# Altium project USB 3.1_to_Gigabit_Ethernet_V1.0.PrjPcb (part 2 of 3)
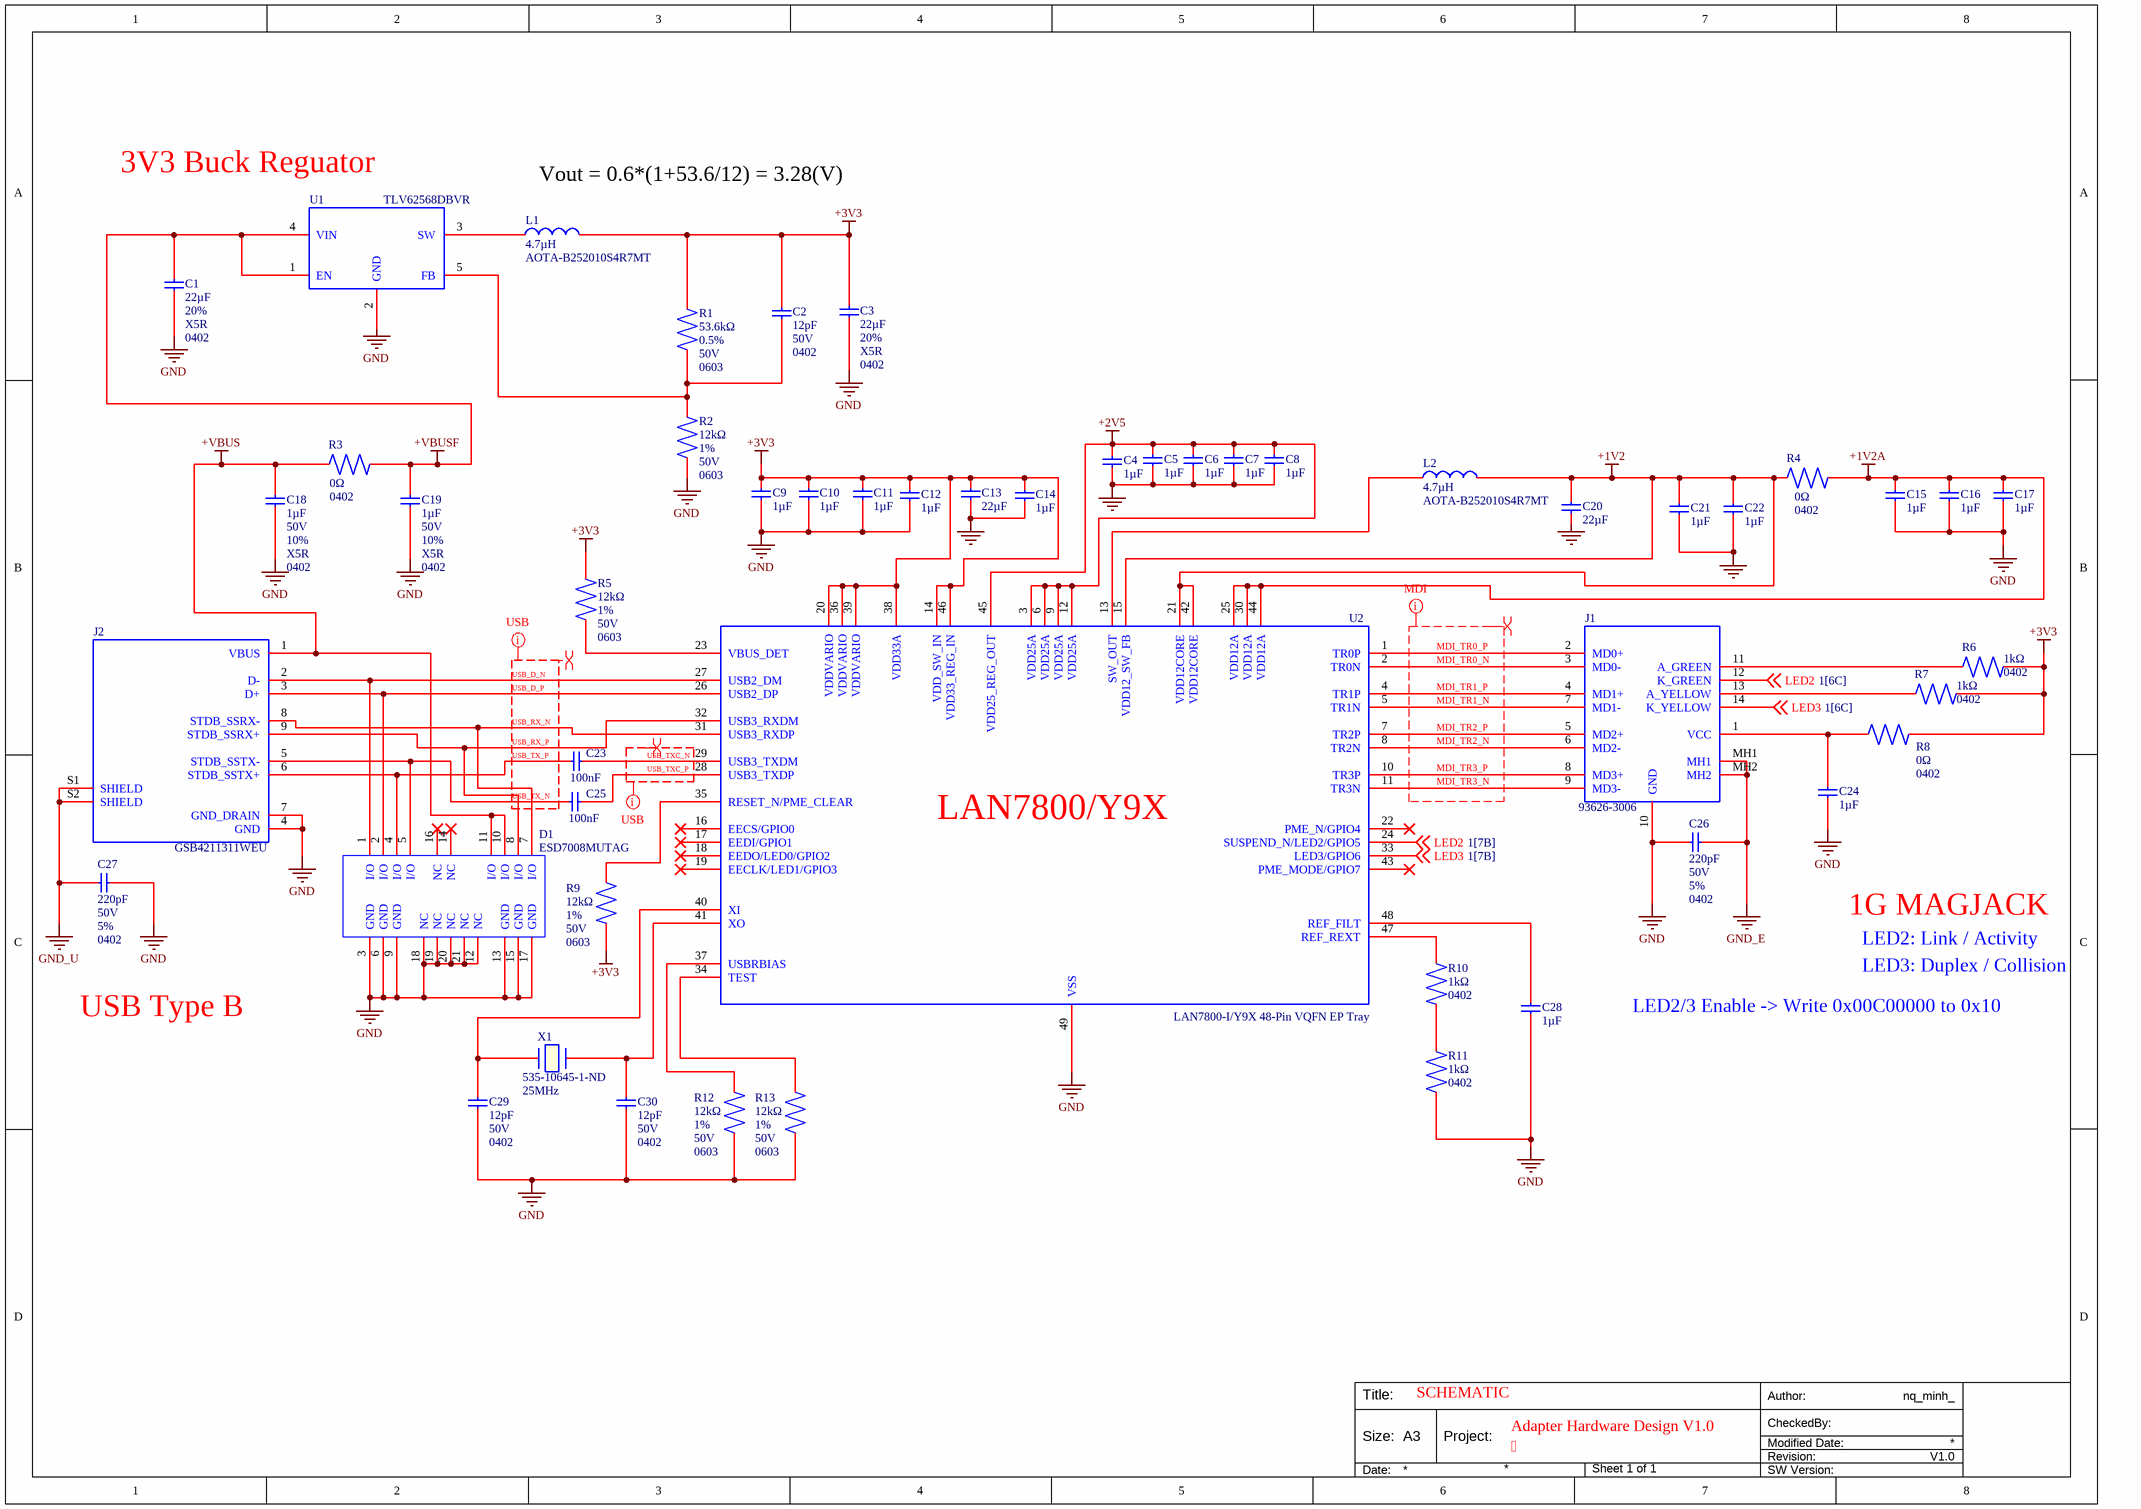
[diagram p1: Schematic.SchDoc]

## Sheet Schematic.SchDoc (continued)
### Library data of the parts
C1 C3 C13 C20 = C0402_MLCC_22uF_X5R_6.3V: 6.3V 22uF X5R ±20% 0402 Multilayer Ceramic Capacitors MLCC - SMD/SMT ROHS; Manufacturer: Murata; Manufacturer Part Number: GRM155R60J226ME11D; Supplier: DigiKey; Supplier Part Number: 490-GRM155R60J226ME11DDKR-ND; RoHS: Compliant; Category: Ceramic Capacitors; Stock: 5573; Pricing: 1=0,29, 10=0,172, 50=0,125, 100=0,1106, 500=0,08622, 1000=0,0787, 2500=0,07077, 5000=0,06599 (USD); Value: 22µF; Dielectric Material: Ceramic; Height: 500µm; Length: 1mm; Lifecycle Status: Production; Max Operating Temperature: 85°C; Min Operating Temperature: -55°C; Mounting Technology: Surface Mount; Number of Terminals: 2; REACH SVHC: Yes; Thickness: 500µm; Voltage Rating (DC): 6.3V; Width: 500µm; ComponentLink1URL: https://datasheet.octopart.com:443/GRM155R60J226ME11D-Murata-datasheet-165579666.pdf?src-supplier=TME; ComponentLink1Description: https://datasheet.octopart.com:443/GRM155R60J226ME11D-Murata-datasheet-165579666.pdf?src-supplier=TME; ComponentLink2URL: https://datasheet.octopart.com:443/GRM155R60J226ME11D-Murata-datasheet-102370999.pdf?src-supplier=HQonline; ComponentLink2Description: https://datasheet.octopart.com:443/GRM155R60J226ME11D-Murata-datasheet-102370999.pdf?src-supplier=HQonline; ComponentLink3URL: https://datasheet.octopart.com/GRM155R60J226ME11D-Murata-datasheet-12515295.pdf; ComponentLink3Description: https://datasheet.octopart.com/GRM155R60J226ME11D-Murata-datasheet-12515295.pdf; ComponentLink4URL: https://datasheet.octopart.com/GRM155R60J226ME11D-Murata-datasheet-12510076.pdf; ComponentLink4Description: https://datasheet.octopart.com/GRM155R60J226ME11D-Murata-datasheet-12510076.pdf; ComponentLink5URL: https://datasheet.octopart.com/GRM155R60J226ME11D-Murata-datasheet-11978611.pdf; ComponentLink5Description: https://datasheet.octopart.com/GRM155R60J226ME11D-Murata-datasheet-11978611.pdf; ComponentLink6URL: https://datasheet.octopart.com/GRM155R60J226ME11D-Murata-datasheet-10025737.pdf; ComponentLink6Description: https://datasheet.octopart.com/GRM155R60J226ME11D-Murata-datasheet-10025737.pdf; ComponentLink7URL: https://datasheet.octopart.com/GRM155R60J226ME11D-Murata-datasheet-8819587.pdf; ComponentLink7Description: https://datasheet.octopart.com/GRM155R60J226ME11D-Murata-datasheet-8819587.pdf; ComponentLink8URL: http://sigma.octopart.com:80/reach_statement/Murata-company-16.pdf?src-supplier=Compliance+Statements; ComponentLink8Description: http://sigma.octopart.com:80/reach_statement/Murata-company-16.pdf?src-supplier=Compliance+Statements; LCSC Part: C415703
  C13 C20: Tolerance: 20%; Dielectric: X5R; Case/Package: 0402
C2 C29 C30 = C0402_MLCC_12pF_c0G_50V: 50V 12pF C0G ±1% 0402 Multilayer Ceramic Capacitors MLCC - SMD/SMT ROHS; Manufacturer: Murata; Manufacturer Part Number: GCM1555C1H120FA16D; Manufacturer Lifecycle Status: IN PRODUCTION; Temperature Coefficient: 30ppm/°C; Supplier: DigiKey; Supplier Part Number: 490-16460-1-ND; RoHS: Compliant; Category: Ceramic Capacitors; Stock: 94279; Pricing: 1=0,1, 10=0,039, 50=0,0262, 100=0,0225, 500=0,01612, 1000=0,01418, 2500=0,01214, 5000=0,01092 (USD); Value: 12pF; Dielectric Material: Ceramic; Export Control Classification Number (ECCN) Code: EAR99; Height: 500µm; Harmonized Tariff Schedule (HTS) Code: 8532.24.00.20; Introduction Date: 2013-11-20; Length: 1mm; Lifecycle Status: Production; Material: Ceramic; Max Operating Temperature: 125°C; Min Operating Temperature: -55°C; Mounting Technology: Surface Mount; Number of Terminals: 2; Ratings: AEC-Q200; REACH SVHC: Yes; Schedule B: 8532240020, 8532240020|8532240020|8532240020|8532240020|8532240020; Thickness: 500µm; Voltage Rating (DC): 50V; Width: 500µm; ComponentLink1URL: https://datasheet.octopart.com:443/GCM1555C1H120FA16D-Murata-datasheet-149522307.pdf?src-supplier=Newark; ComponentLink1Description: https://datasheet.octopart.com:443/GCM1555C1H120FA16D-Murata-datasheet-149522307.pdf?src-supplier=Newark; ComponentLink2URL: https://datasheet.octopart.com:443/GCM1555C1H120FA16D-Murata-datasheet-141265818.pdf?src-supplier=Geoflip; ComponentLink2Description: https://datasheet.octopart.com:443/GCM1555C1H120FA16D-Murata-datasheet-141265818.pdf?src-supplier=Geoflip; ComponentLink3URL: https://datasheet.octopart.com:443/GCM1555C1H120FA16D-Murata-datasheet-140655927.pdf?src-supplier=Ciiva; ComponentLink3Description: https://datasheet.octopart.com:443/GCM1555C1H120FA16D-Murata-datasheet-140655927.pdf?src-supplier=Ciiva; ComponentLink4URL: https://datasheet.octopart.com:443/GCM1555C1H120FA16D-Murata-datasheet-138715618.pdf?src-supplier=Ciiva; ComponentLink4Description: https://datasheet.octopart.com:443/GCM1555C1H120FA16D-Murata-datasheet-138715618.pdf?src-supplier=Ciiva; ComponentLink5URL: https://datasheet.octopart.com:443/GCM1555C1H120FA16D-Murata-datasheet-12511495.pdf?src-supplier=TME; ComponentLink5Description: https://datasheet.octopart.com:443/GCM1555C1H120FA16D-Murata-datasheet-12511495.pdf?src-supplier=TME; ComponentLink6URL: http://sigma.octopart.com:80/reach_statement/Murata-company-16.pdf?src-supplier=Compliance+Statements; ComponentLink6Description: http://sigma.octopart.com:80/reach_statement/Murata-company-16.pdf?src-supplier=Compliance+Statements; LCSC Part: C393682
C4-C12 C14-C19 C21 C22 C24 C28 = C0402_MLCC_1uF_X5R_50V: Ceramic Capacitor, Multilayer, Ceramic, 50V, 10% +Tol, 10% -Tol, X5R, 1uF, Surface Mount, 0402; Manufacturer: Murata; Manufacturer Part Number: GRM155R61H105KE05D; Manufacturer Lifecycle Status: IN PRODUCTION; Supplier: DigiKey; Supplier Part Number: 490-GRM155R61H105KE05DDKR-ND; RoHS: Compliant; Category: Ceramic Capacitors; Stock: 2290440; Pricing: 1=0,1, 10=0,056, 50=0,0382, 100=0,0329, 500=0,0241, 1000=0,02139, 2500=0,01854, 5000=0,01683 (USD); Value: 1µF; Dielectric Material: Ceramic; Export Control Classification Number (ECCN) Code: EAR99; Height: 500µm; Harmonized Tariff Schedule (HTS) Code: 8532.24.00.20; Introduction Date: 2020-01-27; Length: 1mm; Lifecycle Status: Production; Material: Ceramic; Max Operating Temperature: 85°C; Min Operating Temperature: -55°C; Mounting Technology: Surface Mount; Number of Terminals: 2; REACH SVHC: Yes; Thickness: 500µm; Voltage Rating (DC): 50V; Width: 500µm; ComponentLink1URL: https://datasheet.octopart.com:443/GRM155R61H105KE05D-Murata-datasheet-155239061.pdf?src-supplier=Newark; ComponentLink1Description: https://datasheet.octopart.com:443/GRM155R61H105KE05D-Murata-datasheet-155239061.pdf?src-supplier=Newark; ComponentLink2URL: https://datasheet.octopart.com:443/GRM155R61H105KE05D-Murata-datasheet-165579666.pdf?src-supplier=TME; ComponentLink2Description: https://datasheet.octopart.com:443/GRM155R61H105KE05D-Murata-datasheet-165579666.pdf?src-supplier=TME; ComponentLink3URL: https://datasheet.octopart.com:443/GRM155R61H105KE05D-Murata-datasheet-192320400.pdf?src-supplier=HQonline; ComponentLink3Description: https://datasheet.octopart.com:443/GRM155R61H105KE05D-Murata-datasheet-192320400.pdf?src-supplier=HQonline; ComponentLink4URL: https://datasheet.octopart.com:443/GRM155R61H105KE05D-Murata-datasheet-141266224.pdf?src-supplier=Ciiva; ComponentLink4Description: https://datasheet.octopart.com:443/GRM155R61H105KE05D-Murata-datasheet-141266224.pdf?src-supplier=Ciiva; ComponentLink5URL: https://datasheet.octopart.com:443/GRM155R61H105KE05D-Murata-datasheet-140690632.pdf?src-supplier=Ciiva; ComponentLink5Description: https://datasheet.octopart.com:443/GRM155R61H105KE05D-Murata-datasheet-140690632.pdf?src-supplier=Ciiva; ComponentLink6URL: https://datasheet.octopart.com:443/GRM155R61H105KE05D-Murata-datasheet-138740814.pdf?src-supplier=Ciiva; ComponentLink6Description: https://datasheet.octopart.com:443/GRM155R61H105KE05D-Murata-datasheet-138740814.pdf?src-supplier=Ciiva; ComponentLink7URL: https://datasheet.octopart.com/GRM155R61H105KE05D-Murata-datasheet-12515295.pdf; ComponentLink7Description: https://datasheet.octopart.com/GRM155R61H105KE05D-Murata-datasheet-12515295.pdf; ComponentLink8URL: https://datasheet.octopart.com/GRM155R61H105KE05D-Murata-datasheet-12510076.pdf; ComponentLink8Description: https://datasheet.octopart.com/GRM155R61H105KE05D-Murata-datasheet-12510076.pdf; ComponentLink9URL: https://datasheet.octopart.com/GRM155R61H105KE05D-Murata-datasheet-11978611.pdf; ComponentLink9Description: https://datasheet.octopart.com/GRM155R61H105KE05D-Murata-datasheet-11978611.pdf; ComponentLink10URL: https://datasheet.octopart.com/GRM155R61H105KE05D-Murata-datasheet-10025737.pdf; ComponentLink10Description: https://datasheet.octopart.com/GRM155R61H105KE05D-Murata-datasheet-10025737.pdf; ComponentLink11URL: https://datasheet.octopart.com/GRM155R61H105KE05D-Murata-datasheet-8819587.pdf; ComponentLink11Description: https://datasheet.octopart.com/GRM155R61H105KE05D-Murata-datasheet-8819587.pdf; ComponentLink12URL: http://sigma.octopart.com:80/reach_statement/Murata-company-16.pdf?src-supplier=Compliance+Statements; ComponentLink12Description: http://sigma.octopart.com:80/reach_statement/Murata-company-16.pdf?src-supplier=Compliance+Statements; LCSC Part: C1518208
  C4-C12 C14-C17 C21 C22 C24 C28: Voltage Rating: 50V; Tolerance: 10%; Dielectric: X5R; Case/Package: 0402
C23 C25 = C0402_MLCC_100nF_X7R_50V: 50V 100nF X7R ±10% 0402 Multilayer Ceramic Capacitors MLCC - SMD/SMT ROHS; Manufacturer: Yageo Group; Manufacturer Part Number: CC0402KRX7R9BB104; Temperature Coefficient: 30ppm/°C; Supplier: DigiKey; Supplier Part Number: 311-3566-6-ND; RoHS: Compliant; Category: Ceramic Capacitors; Stock: 2445691; Pricing: 1=0,1, 10=0,055, 50=0,0382, 100=0,0329, 500=0,02408, 1000=0,02136, 2500=0,01852, 5000=0,01681 (USD); Value: 100nF; China RoHS: Compliant; Dielectric: X7R; Dielectric Material: Ceramic; Halogen Free: Halogen Free; Height: 500µm; Lead Free: Lead Free; Length: 1mm; Lifecycle Status: Production; Material: Ceramic; Max Operating Temperature: 125°C; Min Operating Temperature: -55°C; Mounting Technology: Surface Mount; Number of Terminals: 2; REACH SVHC: Yes; Schedule B: 8532240020, 8532240020|8532240020, 8532240020|8532240020|8532240020, 8532240020|8532240020|8532240020|8532240020; Thickness: 558.8µm; Voltage Rating (DC): 50V; Width: 500µm; ComponentLink1URL: https://datasheet.octopart.com:443/CC0402KRX7R9BB104-Yageo-datasheet-177165144.pdf?src-supplier=IHS; ComponentLink1Description: https://datasheet.octopart.com:443/CC0402KRX7R9BB104-Yageo-datasheet-177165144.pdf?src-supplier=IHS; ComponentLink2URL: https://datasheet.octopart.com:443/CC0402KRX7R9BB104-Yageo-datasheet-78855684.pdf?src-supplier=Upverter; ComponentLink2Description: https://datasheet.octopart.com:443/CC0402KRX7R9BB104-Yageo-datasheet-78855684.pdf?src-supplier=Upverter; ComponentLink3URL: https://datasheet.octopart.com:443/CC0402KRX7R9BB104-Yageo-datasheet-181967451.pdf?src-supplier=Newark; ComponentLink3Description: https://datasheet.octopart.com:443/CC0402KRX7R9BB104-Yageo-datasheet-181967451.pdf?src-supplier=Newark; ComponentLink4URL: https://datasheet.octopart.com:443/CC0402KRX7R9BB104-Yageo-datasheet-140260305.pdf?src-supplier=Newark; ComponentLink4Description: https://datasheet.octopart.com:443/CC0402KRX7R9BB104-Yageo-datasheet-140260305.pdf?src-supplier=Newark; ComponentLink5URL: https://datasheet.octopart.com:443/CC0402KRX7R9BB104-Yageo-datasheet-147453679.pdf?src-supplier=Farnell; ComponentLink5Description: https://datasheet.octopart.com:443/CC0402KRX7R9BB104-Yageo-datasheet-147453679.pdf?src-supplier=Farnell; ComponentLink6URL: https://datasheet.octopart.com/CC0402KRX7R9BB104-Yageo-datasheet-10883670.pdf; ComponentLink6Description: https://datasheet.octopart.com/CC0402KRX7R9BB104-Yageo-datasheet-10883670.pdf; ComponentLink7URL: https://datasheet.octopart.com/Surface-Mount-Ceramic-Multilayer-Capacitors%3B-General-Purpose-%26-High-Capacitance-Class-2%2C-X7R-Yageo-datasheet-family-114.pdf; ComponentLink7Description: https://datasheet.octopart.com/Surface-Mount-Ceramic-Multilayer-Capacitors%3B-General-Purpose-%26-High-Capacitance-Class-2%2C-X7R-Yageo-datasheet-family-114.pdf; ComponentLink8URL: https://datasheet.octopart.com:443/CC0402KRX7R9BB104-Yageo-datasheet-166511530.pdf?src-supplier=Future+Electronics; ComponentLink8Description: https://datasheet.octopart.com:443/CC0402KRX7R9BB104-Yageo-datasheet-166511530.pdf?src-supplier=Future+Electronics; ComponentLink9URL: https://datasheet.octopart.com:443/CC0402KRX7R9BB104-Yageo-datasheet-137700082.pdf?src-supplier=Future+Electronics; ComponentLink9Description: https://datasheet.octopart.com:443/CC0402KRX7R9BB104-Yageo-datasheet-137700082.pdf?src-supplier=Future+Electronics; ComponentLink10URL: https://datasheet.octopart.com:443/CC0402KRX7R9BB104-Yageo-datasheet-137700084.pdf?src-supplier=Future+Electronics; ComponentLink10Description: https://datasheet.octopart.com:443/CC0402KRX7R9BB104-Yageo-datasheet-137700084.pdf?src-supplier=Future+Electronics; ComponentLink11URL: https://datasheet.octopart.com:443/CC0402KRX7R9BB104-Yageo-datasheet-42079887.pdf?src-supplier=Future+Electronics; ComponentLink11Description: https://datasheet.octopart.com:443/CC0402KRX7R9BB104-Yageo-datasheet-42079887.pdf?src-supplier=Future+Electronics; ComponentLink12URL: https://datasheet.octopart.com:443/CC0402KRX7R9BB104-Yageo-datasheet-178018857.pdf?src-supplier=Burklin+Elektronik; ComponentLink12Description: https://datasheet.octopart.com:443/CC0402KRX7R9BB104-Yageo-datasheet-178018857.pdf?src-supplier=Burklin+Elektronik; ComponentLink13URL: https://datasheet.octopart.com:443/CC0402KRX7R9BB104-Yageo-Group-datasheet-165992755.pdf?src-supplier=ODG+(Origin+Data+Global); ComponentLink13Description: https://datasheet.octopart.com:443/CC0402KRX7R9BB104-Yageo-Group-datasheet-165992755.pdf?src-supplier=ODG+(Origin+Data+Global); ComponentLink14URL: https://datasheet.octopart.com:443/CC0402KRX7R9BB104-Yageo-datasheet-151948686.pdf?src-supplier=TME; ComponentLink14Description: https://datasheet.octopart.com:443/CC0402KRX7R9BB104-Yageo-datasheet-151948686.pdf?src-supplier=TME; ComponentLink15URL: https://datasheet.octopart.com:443/CC0402KRX7R9BB104-Yageo-datasheet-120101875.pdf?src-supplier=Megastar; ComponentLink15Description: https://datasheet.octopart.com:443/CC0402KRX7R9BB104-Yageo-datasheet-120101875.pdf?src-supplier=Megastar; ComponentLink16URL: http://sigma.octopart.com:80/rohs_statement/Surface-Mount-Ceramic-Multilayer-Capacitors%3B-General-Purpose-%26-High-Capacitance-Class-2%2C-X7R-Yageo-family-124.pdf?src-supplier=Compliance+Statements; ComponentLink16Description: http://sigma.octopart.com:80/rohs_statement/Surface-Mount-Ceramic-Multilayer-Capacitors%3B-General-Purpose-%26-High-Capacitance-Class-2%2C-X7R-Yageo-family-124.pdf?src-supplier=Compliance+Statements; ComponentLink17URL: http://sigma.octopart.com:80/reach_statement/Surface-Mount-Ceramic-Multilayer-Capacitors%3B-General-Purpose-%26-High-Capacitance-Class-2%2C-X7R-Yageo-family-125.pdf?src-supplier=Compliance+Statements; ComponentLink17Description: http://sigma.octopart.com:80/reach_statement/Surface-Mount-Ceramic-Multilayer-Capacitors%3B-General-Purpose-%26-High-Capacitance-Class-2%2C-X7R-Yageo-family-125.pdf?src-supplier=Compliance+Statements; ComponentLink18URL: http://sigma.octopart.com:80/conflict_mineral_statement/Yageo-company-3.pdf?src-supplier=Compliance+Statements; ComponentLink18Description: http://sigma.octopart.com:80/conflict_mineral_statement/Yageo-company-3.pdf?src-supplier=Compliance+Statements; ComponentLink19URL: http://sigma.octopart.com:80/rohs_statement/Yageo-company-2.pdf?src-supplier=Compliance+Statements; ComponentLink19Description: http://sigma.octopart.com:80/rohs_statement/Yageo-company-2.pdf?src-supplier=Compliance+Statements; LCSC Part: C131394; Voltage Rating: 50V; Tolerance: 10%; Case/Package: 0402
C26 C27 = C0402_MLCC_220pF_C0G_50V: 50V 220pF C0G ±5% 0402 Multilayer Ceramic Capacitors MLCC - SMD/SMT ROHS; Manufacturer: Murata; Manufacturer Part Number: GRM1555C1H221JA01D; Manufacturer Lifecycle Status: NRND; Insulation Resistance: 10GΩ; Temperature Coefficient: 30ppm/°C; Supplier: DigiKey; Supplier Part Number: 490-1293-6-ND; RoHS: Compliant; Category: Ceramic Capacitors; Stock: 327235; Pricing: 1=0,1, 10=0,03, 50=0,0202, 100=0,0172, 500=0,0122, 1000=0,01067, 2500=0,00906, 5000=0,00809 (USD); Value: 220pF; Case Code (Imperial): 0402; Case Code (Metric): 1005; Depth: 500µm; Dielectric: C0G; Dielectric Material: Ceramic; Height: 500µm; Lead Free: Lead Free; Length: 1mm; Lifecycle Status: NRND; Material: Ceramic; Max Operating Temperature: 125°C; Min Operating Temperature: -55°C; Mounting Technology: Surface Mount; Pins: 2; Number of Terminals: 2; Packaging: Cut Tape; Radiation Hardening: No; REACH SVHC: Yes; Schedule B: 8532240020, 8532240020|8532240020, 8532240020|8532240020|8532240020, 8532240020|8532240020|8532240020|8532240020; Termination: SMD/SMT; Thickness: 500µm; Voltage Rating: 50V; Voltage Rating (DC): 50V; Width: 500µm; ComponentLink1URL: https://datasheet.octopart.com:443/GRM1555C1H221JA01D-Murata-datasheet-501912.pdf?src-supplier=element14+APAC; ComponentLink1Description: https://datasheet.octopart.com:443/GRM1555C1H221JA01D-Murata-datasheet-501912.pdf?src-supplier=element14+APAC; ComponentLink2URL: https://datasheet.octopart.com:443/GRM1555C1H221JA01D-Murata-datasheet-62320221.pdf?src-supplier=element14+APAC; ComponentLink2Description: https://datasheet.octopart.com:443/GRM1555C1H221JA01D-Murata-datasheet-62320221.pdf?src-supplier=element14+APAC; ComponentLink3URL: https://datasheet.octopart.com:443/GRM1555C1H221JA01D-Murata-datasheet-165579666.pdf?src-supplier=TME; ComponentLink3Description: https://datasheet.octopart.com:443/GRM1555C1H221JA01D-Murata-datasheet-165579666.pdf?src-supplier=TME; ComponentLink4URL: https://datasheet.octopart.com:443/GRM1555C1H221JA01D-Murata-datasheet-59876780.pdf?src-supplier=TME; ComponentLink4Description: https://datasheet.octopart.com:443/GRM1555C1H221JA01D-Murata-datasheet-59876780.pdf?src-supplier=TME; ComponentLink5URL: https://datasheet.octopart.com:443/GRM1555C1H221JA01D-Murata-datasheet-141266224.pdf?src-supplier=Ciiva; ComponentLink5Description: https://datasheet.octopart.com:443/GRM1555C1H221JA01D-Murata-datasheet-141266224.pdf?src-supplier=Ciiva; ComponentLink6URL: https://datasheet.octopart.com:443/GRM1555C1H221JA01D-Murata-datasheet-140681357.pdf?src-supplier=Ciiva; ComponentLink6Description: https://datasheet.octopart.com:443/GRM1555C1H221JA01D-Murata-datasheet-140681357.pdf?src-supplier=Ciiva; ComponentLink7URL: https://datasheet.octopart.com:443/GRM1555C1H221JA01D-Murata-datasheet-138739519.pdf?src-supplier=Ciiva; ComponentLink7Description: https://datasheet.octopart.com:443/GRM1555C1H221JA01D-Murata-datasheet-138739519.pdf?src-supplier=Ciiva; ComponentLink8URL: https://datasheet.octopart.com:443/GRM1555C1H221JA01D-Murata-datasheet-120101189.pdf?src-supplier=Megastar; ComponentLink8Description: https://datasheet.octopart.com:443/GRM1555C1H221JA01D-Murata-datasheet-120101189.pdf?src-supplier=Megastar; ComponentLink9URL: https://datasheet.octopart.com:443/GRM1555C1H221JA01D-Murata-datasheet-22122223.pdf?src-supplier=Future+Electronics; ComponentLink9Description: https://datasheet.octopart.com:443/GRM1555C1H221JA01D-Murata-datasheet-22122223.pdf?src-supplier=Future+Electronics; ComponentLink10URL: https://datasheet.octopart.com:443/GRM1555C1H221JA01D-Murata-datasheet-12510170.pdf?src-supplier=Future+Electronics; ComponentLink10Description: https://datasheet.octopart.com:443/GRM1555C1H221JA01D-Murata-datasheet-12510170.pdf?src-supplier=Future+Electronics; ComponentLink11URL: https://datasheet.octopart.com:443/GRM1555C1H221JA01D-Murata-datasheet-8324201.pdf?src-supplier=Future+Electronics; ComponentLink11Description: https://datasheet.octopart.com:443/GRM1555C1H221JA01D-Murata-datasheet-8324201.pdf?src-supplier=Future+Electronics; ComponentLink12URL: https://datasheet.octopart.com:443/GRM1555C1H221JA01D-Murata-datasheet-552801.pdf?src-supplier=Future+Electronics; ComponentLink12Description: https://datasheet.octopart.com:443/GRM1555C1H221JA01D-Murata-datasheet-552801.pdf?src-supplier=Future+Electronics; ComponentLink13URL: https://datasheet.octopart.com:443/GRM1555C1H221JA01D-Murata-datasheet-44105895.pdf?src-supplier=Future+Electronics; ComponentLink13Description: https://datasheet.octopart.com:443/GRM1555C1H221JA01D-Murata-datasheet-44105895.pdf?src-supplier=Future+Electronics; ComponentLink14URL: https://datasheet.octopart.com/GRM1555C1H221JA01D-Murata-datasheet-12515295.pdf; ComponentLink14Description: https://datasheet.octopart.com/GRM1555C1H221JA01D-Murata-datasheet-12515295.pdf; ComponentLink15URL: https://datasheet.octopart.com/GRM1555C1H221JA01D-Murata-datasheet-12510076.pdf; ComponentLink15Description: https://datasheet.octopart.com/GRM1555C1H221JA01D-Murata-datasheet-12510076.pdf; ComponentLink16URL: https://datasheet.octopart.com/GRM1555C1H221JA01D-Murata-datasheet-11978611.pdf; ComponentLink16Description: https://datasheet.octopart.com/GRM1555C1H221JA01D-Murata-datasheet-11978611.pdf; ComponentLink17URL: https://datasheet.octopart.com/GRM1555C1H221JA01D-Murata-datasheet-10025737.pdf; ComponentLink17Description: https://datasheet.octopart.com/GRM1555C1H221JA01D-Murata-datasheet-10025737.pdf; ComponentLink18URL: https://datasheet.octopart.com/GRM1555C1H221JA01D-Murata-datasheet-8819587.pdf; ComponentLink18Description: https://datasheet.octopart.com/GRM1555C1H221JA01D-Murata-datasheet-8819587.pdf; ComponentLink19URL: https://datasheet.octopart.com/GRM1555C1H221JA01D-Murata-datasheet-12544403.pdf; ComponentLink19Description: https://datasheet.octopart.com/GRM1555C1H221JA01D-Murata-datasheet-12544403.pdf; ComponentLink20URL: https://datasheet.octopart.com:443/GRM1555C1H221JA01D-Murata-datasheet-11841991.pdf?src-supplier=Arrow+Electronics; ComponentLink20Description: https://datasheet.octopart.com:443/GRM1555C1H221JA01D-Murata-datasheet-11841991.pdf?src-supplier=Arrow+Electronics; ComponentLink21URL: https://datasheet.octopart.com:443/GRM1555C1H221JA01D-Murata-datasheet-7558141.pdf?src-supplier=Jameco; ComponentLink21Description: https://datasheet.octopart.com:443/GRM1555C1H221JA01D-Murata-datasheet-7558141.pdf?src-supplier=Jameco; ComponentLink22URL: https://datasheet.octopart.com:443/GRM1555C1H221JA01D-Murata-datasheet-148211.pdf?src-supplier=Garrett; ComponentLink22Description: https://datasheet.octopart.com:443/GRM1555C1H221JA01D-Murata-datasheet-148211.pdf?src-supplier=Garrett; ComponentLink23URL: https://datasheet.octopart.com:443/GRM1555C1H221JA01D-Murata-datasheet-102.pdf?src-supplier=DigiKey; ComponentLink23Description: https://datasheet.octopart.com:443/GRM1555C1H221JA01D-Murata-datasheet-102.pdf?src-supplier=DigiKey; ComponentLink24URL: https://datasheet.octopart.com:443/GRM1555C1H221JA01D-Murata-datasheet-514334.pdf?src-supplier=Farnell; ComponentLink24Description: https://datasheet.octopart.com:443/GRM1555C1H221JA01D-Murata-datasheet-514334.pdf?src-supplier=Farnell; ComponentLink25URL: http://sigma.octopart.com:80/reach_statement/Murata-company-16.pdf?src-supplier=Compliance+Statements; ComponentLink25Description: http://sigma.octopart.com:80/reach_statement/Murata-company-16.pdf?src-supplier=Compliance+Statements; LCSC Part: C71693
D1 = ESD7008MUTAG: ESD Suppressor Diode TVS Bi-Dir 5V 10Vc 18-Pin UDFN EP T/R; Manufacturer: onsemi; Manufacturer Lifecycle Status: ACTIVE; Breakdown Voltage: 6.7V; Value: 150fF; Clamping Voltage: 10V; Direction: Bidirectional; ESD Protection: Yes; Leakage Current: 1µA; Max Surge Current: 16A; Min Breakdown Voltage: 5.5V; Number of Bidirectional Channels: 8; Peak Pulse Current: 1A; Polarity: Unidirectional; Power Line Protection: No; Supplier: DigiKey; Supplier Part Number: ESD7008MUTAGOSCT-ND; Manufacturer Part Number: ESD7008MUTAG; RoHS: Compliant; Category: TVS Diodes; Pricing: 1=1,66, 10=1,048, 100=0,6981, 500=0,54792, 1000=0,49959 (USD); China RoHS: Compliant; Composition: Zener; Contact Plating: Tin; Country of Origin: Malaysia; Depth: 1.5mm; Export Control Classification Number (ECCN) Code: EAR99; Halogen Free: Halogen Free; Height: 500µm; Harmonized Tariff Schedule (HTS) Code: 8541.10.00.50; Introduction Date: 2011-08-22; Lead Free: Lead Free; Length: 5.5mm; Lifecycle Status: Production; Max Operating Temperature: 125°C; Max Reverse Leakage Current: 1µA; Min Operating Temperature: -55°C; Number of Channels: 8; Number of Elements: 8; Number of Lines: 8; Pins: 18; Number of Terminals: 18; Operating Supply Voltage: 5V; Packaging: Tape and Reel; Peak Reverse Current: 1µA; Radiation Hardening: No; REACH SVHC: Yes; Reverse Standoff Voltage: 5V; Schedule B: 8536300000|8536300000|8536300000|8536300000|8536300000|8536300000|8536300000|8536300000|8536300000|8536300000|8536300000|8536300000|8536300000|8536300000|8536300000|8536300000|8536300000|8536300000|8536300000|8536300000|8536300000|8536300000|8536300000|85; Termination: SMD/SMT; Width: 1.5mm; Working Voltage: 5V; ComponentLink1URL: https://datasheet.octopart.com:443/ESD7008MUTAG-onsemi-datasheet-170667543.pdf?src-supplier=Farnell; ComponentLink1Description: https://datasheet.octopart.com:443/ESD7008MUTAG-onsemi-datasheet-170667543.pdf?src-supplier=Farnell; ComponentLink2URL: https://datasheet.octopart.com:443/ESD7008MUTAG-ON-Semiconductor-datasheet-139009825.pdf?src-supplier=Upverter; ComponentLink2Description: https://datasheet.octopart.com:443/ESD7008MUTAG-ON-Semiconductor-datasheet-139009825.pdf?src-supplier=Upverter; ComponentLink3URL: https://datasheet.octopart.com:443/ESD7008MUTAG-ON-Semiconductor-datasheet-11791752.pdf?src-supplier=HQonline; ComponentLink3Description: https://datasheet.octopart.com:443/ESD7008MUTAG-ON-Semiconductor-datasheet-11791752.pdf?src-supplier=HQonline; ComponentLink4URL: https://datasheet.octopart.com:443/ESD7008MUTAG-ON-Semiconductor-datasheet-78758468.pdf?src-supplier=Newark; ComponentLink4Description: https://datasheet.octopart.com:443/ESD7008MUTAG-ON-Semiconductor-datasheet-78758468.pdf?src-supplier=Newark; ComponentLink5URL: https://datasheet.octopart.com:443/ESD7008MUTAG-onsemi-datasheet-164731278.pdf?src-supplier=Newchip+Electronics+Limited; ComponentLink5Description: https://datasheet.octopart.com:443/ESD7008MUTAG-onsemi-datasheet-164731278.pdf?src-supplier=Newchip+Electronics+Limited; ComponentLink6URL: https://datasheet.octopart.com:443/ESD7008MUTAG-ON-Semiconductor-datasheet-110755763.pdf?src-supplier=RS+(Formerly+Allied+Electronics); ComponentLink6Description: https://datasheet.octopart.com:443/ESD7008MUTAG-ON-Semiconductor-datasheet-110755763.pdf?src-supplier=RS+(Formerly+Allied+Electronics); ComponentLink7URL: http://sigma.octopart.com:80/15540786/rohs_certificate/ON-Semiconductor-ESD7008MUTAG.pdf?src-supplier=Compliance+Statements; ComponentLink7Description: http://sigma.octopart.com:80/15540786/rohs_certificate/ON-Semiconductor-ESD7008MUTAG.pdf?src-supplier=Compliance+Statements; ComponentLink8URL: http://sigma.octopart.com:80/15676147/materials_sheet/ON-Semiconductor-ESD7008MUTAG.csv?src-supplier=Compliance+Statements; ComponentLink8Description: http://sigma.octopart.com:80/15676147/materials_sheet/ON-Semiconductor-ESD7008MUTAG.csv?src-supplier=Compliance+Statements; ComponentLink9URL: http://sigma.octopart.com:80/150607531/rohs_statement/ON-Semiconductor-ESD7008MUTAG.pdf?src-supplier=Compliance+Statements; ComponentLink9Description: http://sigma.octopart.com:80/150607531/rohs_statement/ON-Semiconductor-ESD7008MUTAG.pdf?src-supplier=Compliance+Statements; ComponentLink10URL: http://sigma.octopart.com:80/reach_statement/ON-Semiconductor-company-79.pdf?src-supplier=Compliance+Statements; ComponentLink10Description: http://sigma.octopart.com:80/reach_statement/ON-Semiconductor-company-79.pdf?src-supplier=Compliance+Statements; ComponentLink11URL: https://octopart.com:443/opatz8j6/c1?t=eJPUGHskUCjWHzRTcCm9FTuNwW_60uC7xxrGvBqXql9RnIplMsaR7f0ybKxS61_50tAtnBcg_z153n0-Evpu3YTz85Kll6SF8V-h7K1wBd-17R9sTn-om2PG0j3Sjoq31y7q7K-9QtPe93rM_m7vEIYkWl-4MQIXdG-nV4H_6jVia_KlVCkJQyYlBJYsWvAOx_FLm-IGCtyREI8XJlWZ68jDJJbigHVX74egp1OqwDe75zTnjVBkXh5dqnPEFdA-8RJSMjNITdpQEPozHnXrrDsNghMWrK-CSdee0nt_KACcwH1m7tJAXfei7WALMw1AbVU1NJwwCPjEhcaz1EOQMJDUxszsgKGf9y02UffTnA&src-supplier=Compliance+Statements; ComponentLink11Description: https://octopart.com:443/opatz8j6/c1?t=eJPUGHskUCjWHzRTcCm9FTuNwW_60uC7xxrGvBqXql9RnIplMsaR7f0ybKxS61_50tAtnBcg_z153n0-Evpu3YTz85Kll6SF8V-h7K1wBd-17R9sTn-om2PG0j3Sjoq31y7q7K-9QtPe93rM_m7vEIYkWl-4MQIXdG-nV4H_6jVia_KlVCkJQyYlBJYsWvAOx_FLm-IGCtyREI8XJlWZ68jDJJbigHVX74egp1OqwDe75zTnjVBkXh5dqnPEFdA-8RJSMjNITdpQEPozHnXrrDsNghMWrK-CSdee0nt_KACcwH1m7tJAXfei7WALMw1AbVU1NJwwCPjEhcaz1EOQMJDUxszsgKGf9y02UffTnA&src-supplier=Compliance+Statements; ComponentLink12URL: https://octopart.com:443/opatz8j6/c1?t=Q--1XnQq8nn3HDM6-oyBDP4Hk7CmCu85E0c0zGkWhhG76gQgF4Yed-BocdSuHyotIN3eHIvp2O44DitdkCkAWViF-D3tTxeRAIb-rBAsSALMoMt_pJtCBpLoxrqcGsb9kzrJKvkIpu1gkwdl0i8qiXdRDT0nq3nfP5o8KfYlhgwgATSjyuViSxFBjnVUgPMeeGT2yKt-NDtQjN3KL9BZnI-kF8UY5x2V1AoQg_4vTUYzD4KXGaHyCyS1cFyDfHfhMRFgWpRfN62WymcPL0SnYenywxhRAFGm-Mz5q4Bw2yWAg-vHjgqNfRM_uh_L4ryMOMaY6pMncDyUGJphmeZ_jrqZ7snqyzMqxFuGLQmuOeA&src-supplier=Compliance+Statements; ComponentLink12Description: https://octopart.com:443/opatz8j6/c1?t=Q--1XnQq8nn3HDM6-oyBDP4Hk7CmCu85E0c0zGkWhhG76gQgF4Yed-BocdSuHyotIN3eHIvp2O44DitdkCkAWViF-D3tTxeRAIb-rBAsSALMoMt_pJtCBpLoxrqcGsb9kzrJKvkIpu1gkwdl0i8qiXdRDT0nq3nfP5o8KfYlhgwgATSjyuViSxFBjnVUgPMeeGT2yKt-NDtQjN3KL9BZnI-kF8UY5x2V1AoQg_4vTUYzD4KXGaHyCyS1cFyDfHfhMRFgWpRfN62WymcPL0SnYenywxhRAFGm-Mz5q4Bw2yWAg-vHjgqNfRM_uh_L4ryMOMaY6pMncDyUGJphmeZ_jrqZ7snqyzMqxFuGLQmuOeA&src-supplier=Compliance+Statements; LCSC Part: C260424
J1 = 93626-3006: Modular Connectors / Ethernet Connectors MXMag GIG 8CORE RJ45 W/ LEDs GRN/YLW RA; Manufacturer: Molex; Manufacturer Lifecycle Status: ACTIVE; Contact Resistance: 5mΩ; Current Rating: 500mA; Dielectric Material: Liquid Crystal Polymer; Gender: Female; Insulation Resistance: 500MΩ; Number of Contacts: 10; Number of Ports: 1; Number of Positions: 8; Plating: Tin; Row Spacing: 2.54mm; Voltage Rating: 125V; Supplier: DigiKey; Supplier Part Number: WM17615-ND; Manufacturer Part Number: 93626-3006; RoHS: Compliant; Category: Modular / Ethernet Connectors; Pricing: 1=9,7, 10=8,241, 25=7,724, 56=7,29679, 112=6,94848, 280=6,51361, 504=6,24925, 1008=5,95129 (USD); China RoHS: Compliant; Contact Material: Gold, Nickel; Country of Origin: IE; Depth: 21.4mm; Export Control Classification Number (ECCN) Code: EAR99; Height: 15.4mm; Harmonized Tariff Schedule (HTS) Code: 8536.69.40.30; Insulation Color: Black; Introduction Date: 2017-04-25; Length: 21.4mm; Lifecycle Status: Production; Max Operating Temperature: 70°C; Min Operating Temperature: 0°C; Pins: 8; Number of Rows: 2; Orientation: Right Angle; REACH SVHC: Yes; Shell Finish: Nickel; Shell Material: Brass; Terminal Pitch: 2.54mm; Termination: Solder; ComponentLink1URL: https://datasheet.octopart.com:443/936263006-Molex-datasheet-148499619.pdf?src-supplier=Molex; ComponentLink1Description: https://datasheet.octopart.com:443/936263006-Molex-datasheet-148499619.pdf?src-supplier=Molex; ComponentLink2URL: https://datasheet.octopart.com:443/93626-3006-Molex-datasheet-134576264.pdf?src-supplier=TME; ComponentLink2Description: https://datasheet.octopart.com:443/93626-3006-Molex-datasheet-134576264.pdf?src-supplier=TME; ComponentLink3URL: https://datasheet.octopart.com:443/93626-3006-Molex-datasheet-192977032.pdf?src-supplier=Farnell; ComponentLink3Description: https://datasheet.octopart.com:443/93626-3006-Molex-datasheet-192977032.pdf?src-supplier=Farnell; ComponentLink4URL: https://datasheet.octopart.com:443/93626-3006-Molex-datasheet-101610786.pdf?src-supplier=Farnell; ComponentLink4Description: https://datasheet.octopart.com:443/93626-3006-Molex-datasheet-101610786.pdf?src-supplier=Farnell; ComponentLink5URL: http://sigma.octopart.com:80/reach_statement/Molex-company-74.pdf?src-supplier=Compliance+Statements; ComponentLink5Description: http://sigma.octopart.com:80/reach_statement/Molex-company-74.pdf?src-supplier=Compliance+Statements; ComponentLink6URL: http://sigma.octopart.com:80/rohs_statement/Molex-company-73.pdf?src-supplier=Compliance+Statements; ComponentLink6Description: http://sigma.octopart.com:80/rohs_statement/Molex-company-73.pdf?src-supplier=Compliance+Statements; ComponentLink7URL: http://sigma.octopart.com:80/conflict_mineral_statement/Molex-company-72.pdf?src-supplier=Compliance+Statements; ComponentLink7Description: http://sigma.octopart.com:80/conflict_mineral_statement/Molex-company-72.pdf?src-supplier=Compliance+Statements; LCSC Part: C6377799
J2 = GSB4211311WEU: USB Connector, 4 Contact(s), Female, Right Angle, Solder Terminal, Receptacle; Manufacturer: Amphenol; Number of Contacts: 9; Number of Positions: 4; Supplier: DigiKey; Supplier Part Number: GSB4211311WEU-ND; Manufacturer Part Number: GSB4211311WEU; RoHS: Compliant; Category: USB Connectors; Stock: 5889; Pricing: 1=1,8, 10=1,533, 25=1,4368, 50=1,368, 100=1,3026, 250=1,22092, 500=1,16264, 1500=1,07593, 3000=1,0246 (USD); Connector Type: USB; Export Control Classification Number (ECCN) Code: EAR99; Gender: Female; Harmonized Tariff Schedule (HTS) Code: 8536.69.40.30; Introduction Date: 2014-08-04; Lifecycle Status: Production; Mounting Technology: Through Hole; Orientation: Right Angle; REACH SVHC: Yes; Shell Finish: Nickel; Termination: Solder; ComponentLink1URL: https://datasheet.octopart.com:443/GSB4211311WEU-Amphenol-datasheet-182249119.pdf?src-supplier=IHS; ComponentLink1Description: https://datasheet.octopart.com:443/GSB4211311WEU-Amphenol-datasheet-182249119.pdf?src-supplier=IHS; ComponentLink2URL: https://datasheet.octopart.com:443/GSB4211311WEU-Amphenol-ICC---FCI-datasheet-154727458.pdf?src-supplier=Master+Electronics; ComponentLink2Description: https://datasheet.octopart.com:443/GSB4211311WEU-Amphenol-ICC---FCI-datasheet-154727458.pdf?src-supplier=Master+Electronics; ComponentLink3URL: https://datasheet.octopart.com:443/GSB4211311WEU-Amphenol-datasheet-62278742.pdf?src-supplier=Electro+Sonic; ComponentLink3Description: https://datasheet.octopart.com:443/GSB4211311WEU-Amphenol-datasheet-62278742.pdf?src-supplier=Electro+Sonic; LCSC Part: C5429210
L1 L2 = AOTA-B252010S4R7MT: Inductor Power Mini Molded/Shielded Wirewound 4.7uH 20% 1MHz 1.6A 0.136Ohm DCR 1008; Manufacturer: Abracon; DC Resistance (DCR): 136mΩ; Number of Circuits: 1; Self Resonant Frequency: 19MHz; Supplier: DigiKey; Supplier Part Number: 535-AOTA-B252010S4R7MTCT-ND; RoHS: Compliant; Category: Fixed Inductors; Stock: 7663; Pricing: 1=0,19, 10=0,157, 100=0,129, 1000=0,10609 (USD); Case/Package: 1008; China RoHS: Compliant; Export Control Classification Number (ECCN) Code: EAR99; Height: 1mm; Harmonized Tariff Schedule (HTS) Code: 8504.50.80.00; Value: 4.7µH; Introduction Date: 2023-08-01; Length: 2.5mm; Lifecycle Status: Production; Max Current Rating: 1.6A; Max Operating Temperature: 125°C; Min Operating Temperature: -40°C; Number of Terminals: 2; REACH SVHC: Yes; Shielding: Shielded; Test Frequency: 1MHz; Tolerance: 20%; Width: 2mm; ComponentLink1URL: https://datasheet.octopart.com:443/AOTA-B252010S4R7MT-Abracon-datasheet-182207527.pdf?src-supplier=Master+Electronics; ComponentLink1Description: https://datasheet.octopart.com:443/AOTA-B252010S4R7MT-Abracon-datasheet-182207527.pdf?src-supplier=Master+Electronics; ComponentLink2URL: http://sigma.octopart.com:80/conflict_mineral_statement/Abracon-company-27.pdf?src-supplier=Compliance+Statements; ComponentLink2Description: http://sigma.octopart.com:80/conflict_mineral_statement/Abracon-company-27.pdf?src-supplier=Compliance+Statements; LCSC Part: C24991964; Manufacturer Part Number: AOTA-B252010S4R7MT
R1 = R0603_53.6kΩ_±0.5%: Fixed Resistor, Thin Film, 0.1W, 53600ohm, 75V, 0.5% +/-Tol, 50ppm/Cel, Surface Mount, 0603; Manufacturer: Yageo Group; Manufacturer Part Number: RT0603DRE0753K6L; Max Power Dissipation: 100mW; Temperature Coefficient: 50ppm/°C; Supplier: DigiKey; Supplier Part Number: 311-2618-1-ND; RoHS: Compliant; Category: Chip SMD Resistors; Stock: 20044; Pricing: 1=0,1, 10=0,02, 25=0,0192, 50=0,018, 100=0,0171, 250=0,01584, 500=0,01496, 1000=0,01415 (USD); Case Code (Imperial): 0603; China RoHS: Non-Compliant; Composition: Thin Film; Country of Origin: Mainland China, Taiwan; Export Control Classification Number (ECCN) Code: EAR99; Features: Moisture Resistant; Height: 450µm; Harmonized Tariff Schedule (HTS) Code: 8533.21.00.30; Introduction Date: 2008-07-11; Lead Free: Lead Free; Length: 1.6mm; Lifecycle Status: Production; Max Operating Temperature: 155°C; Min Operating Temperature: -55°C; Mounting Technology: Surface Mount; Number of Terminals: 2; Number of Terminations: 2; Packaging: Tape & Reel (TR); Power Rating: 100mW; REACH SVHC: Yes; Value: 53.6kΩ; Schedule B: 8533210045; Voltage Rating: 75V; Width: 800µm; Working Voltage: 75V; ComponentLink1URL: https://datasheet.octopart.com:443/RT0603DRE0753K6L-Yageo-datasheet-176402239.pdf?src-supplier=Future+Electronics; ComponentLink1Description: https://datasheet.octopart.com:443/RT0603DRE0753K6L-Yageo-datasheet-176402239.pdf?src-supplier=Future+Electronics; ComponentLink2URL: https://datasheet.octopart.com:443/RT0603DRE0753K6L-Yageo-datasheet-169971040.pdf?src-supplier=Future+Electronics; ComponentLink2Description: https://datasheet.octopart.com:443/RT0603DRE0753K6L-Yageo-datasheet-169971040.pdf?src-supplier=Future+Electronics; ComponentLink3URL: https://datasheet.octopart.com:443/RT0603DRE0753K6L-Yageo-datasheet-166250672.pdf?src-supplier=Future+Electronics; ComponentLink3Description: https://datasheet.octopart.com:443/RT0603DRE0753K6L-Yageo-datasheet-166250672.pdf?src-supplier=Future+Electronics; ComponentLink4URL: https://datasheet.octopart.com:443/RT0603DRE0753K6L-Yageo-datasheet-136673517.pdf?src-supplier=Future+Electronics; ComponentLink4Description: https://datasheet.octopart.com:443/RT0603DRE0753K6L-Yageo-datasheet-136673517.pdf?src-supplier=Future+Electronics; ComponentLink5URL: https://datasheet.octopart.com:443/RT0603DRE0753K6L-Yageo-datasheet-137700930.pdf?src-supplier=Future+Electronics; ComponentLink5Description: https://datasheet.octopart.com:443/RT0603DRE0753K6L-Yageo-datasheet-137700930.pdf?src-supplier=Future+Electronics; ComponentLink6URL: https://datasheet.octopart.com:443/RT0603DRE0753K6L-Yageo-datasheet-96443642.pdf?src-supplier=Upverter; ComponentLink6Description: https://datasheet.octopart.com:443/RT0603DRE0753K6L-Yageo-datasheet-96443642.pdf?src-supplier=Upverter; ComponentLink7URL: https://datasheet.octopart.com/RT0603DRE0753K6L-Yageo-datasheet-86813807.pdf; ComponentLink7Description: https://datasheet.octopart.com/RT0603DRE0753K6L-Yageo-datasheet-86813807.pdf; ComponentLink8URL: http://sigma.octopart.com:80/rohs_statement/Yageo-company-2.pdf?src-supplier=Compliance+Statements; ComponentLink8Description: http://sigma.octopart.com:80/rohs_statement/Yageo-company-2.pdf?src-supplier=Compliance+Statements; ComponentLink9URL: http://sigma.octopart.com:80/conflict_mineral_statement/Yageo-company-3.pdf?src-supplier=Compliance+Statements; ComponentLink9Description: http://sigma.octopart.com:80/conflict_mineral_statement/Yageo-company-3.pdf?src-supplier=Compliance+Statements; LCSC Part: C863153
R2 R5 R9 R12 R13 = R0603_12kΩ_±1%: 100mW Thick Film Resistors 75V ±100ppm/℃ ±1% 12kΩ 0603 Chip Resistor - Surface Mount ROHS; Manufacturer: Yageo Group; Manufacturer Part Number: RC0603FR-0712KL; Temperature Coefficient: 100ppm/°C; Supplier: DigiKey; Supplier Part Number: 311-12.0KHRCT-ND; RoHS: Compliant; Category: Chip SMD Resistors; Stock: 279862; Pricing: 1=0,1, 10=0,025, 25=0,0188, 50=0,015, 100=0,0122, 250=0,0094, 500=0,00782, 1000=0,00661 (USD); Case Code (Imperial): 0603; Case Code (Metric): 1608; China RoHS: Non-Compliant; Composition: Thick Film; Depth: 800µm; Features: Moisture Resistant; Height: 450µm; Lead Free: Lead Free; Length: 1.6mm; Lifecycle Status: Production; Max Operating Temperature: 155°C; Max Power Dissipation: 100mW; Military Standard: Not; Min Operating Temperature: -55°C; Mounting Technology: Surface Mount; Pins: 2; Number of Terminals: 2; Number of Terminations: 2; Packaging: Tape and Reel; Power Rating: 100mW; REACH SVHC: Yes; Value: 12kΩ; Schedule B: 8533210045, 8533210045|8533210045|8533210045|8533210045|8533210045; Termination: SMD/SMT; Voltage Rating (DC): 50V; Width: 800µm; Working Voltage: 75V; ComponentLink1URL: https://datasheet.octopart.com:443/RC0603FR-0712KL-Yageo-datasheet-175887523.pdf?src-supplier=IHS; ComponentLink1Description: https://datasheet.octopart.com:443/RC0603FR-0712KL-Yageo-datasheet-175887523.pdf?src-supplier=IHS; ComponentLink2URL: https://datasheet.octopart.com:443/RC0603FR-0712KL-Yageo-datasheet-8328172.pdf?src-supplier=Newark; ComponentLink2Description: https://datasheet.octopart.com:443/RC0603FR-0712KL-Yageo-datasheet-8328172.pdf?src-supplier=Newark; ComponentLink3URL: https://datasheet.octopart.com:443/RC0603FR-0712KL-Yageo-datasheet-175423674.pdf?src-supplier=Newark; ComponentLink3Description: https://datasheet.octopart.com:443/RC0603FR-0712KL-Yageo-datasheet-175423674.pdf?src-supplier=Newark; ComponentLink4URL: https://datasheet.octopart.com:443/RC0603FR-0712KL-Yageo-datasheet-34211833.pdf?src-supplier=Newark; ComponentLink4Description: https://datasheet.octopart.com:443/RC0603FR-0712KL-Yageo-datasheet-34211833.pdf?src-supplier=Newark; ComponentLink5URL: https://datasheet.octopart.com:443/RC0603FR-0712KL-Yageo-datasheet-62067350.pdf?src-supplier=element14+APAC; ComponentLink5Description: https://datasheet.octopart.com:443/RC0603FR-0712KL-Yageo-datasheet-62067350.pdf?src-supplier=element14+APAC; ComponentLink6URL: https://datasheet.octopart.com:443/RC0603FR-0712KL-Yageo-datasheet-103092701.pdf?src-supplier=Upverter; ComponentLink6Description: https://datasheet.octopart.com:443/RC0603FR-0712KL-Yageo-datasheet-103092701.pdf?src-supplier=Upverter; ComponentLink7URL: https://datasheet.octopart.com:443/RC0603FR-0712KL-Yageo-datasheet-141435368.pdf?src-supplier=Upverter; ComponentLink7Description: https://datasheet.octopart.com:443/RC0603FR-0712KL-Yageo-datasheet-141435368.pdf?src-supplier=Upverter; ComponentLink8URL: https://datasheet.octopart.com:443/RC0603FR-0712KL-Yageo-Group-datasheet-190305687.pdf?src-supplier=Future+Electronics; ComponentLink8Description: https://datasheet.octopart.com:443/RC0603FR-0712KL-Yageo-Group-datasheet-190305687.pdf?src-supplier=Future+Electronics; ComponentLink9URL: https://datasheet.octopart.com:443/RC0603FR-0712KL-Yageo-datasheet-164759695.pdf?src-supplier=Future+Electronics; ComponentLink9Description: https://datasheet.octopart.com:443/RC0603FR-0712KL-Yageo-datasheet-164759695.pdf?src-supplier=Future+Electronics; ComponentLink10URL: https://datasheet.octopart.com:443/RC0603FR-0712KL-Yageo-datasheet-137700087.pdf?src-supplier=Future+Electronics; ComponentLink10Description: https://datasheet.octopart.com:443/RC0603FR-0712KL-Yageo-datasheet-137700087.pdf?src-supplier=Future+Electronics; ComponentLink11URL: https://datasheet.octopart.com:443/RC0603FR0712KL-Yageo-datasheet-27584510.pdf?src-supplier=Future+Electronics; ComponentLink11Description: https://datasheet.octopart.com:443/RC0603FR0712KL-Yageo-datasheet-27584510.pdf?src-supplier=Future+Electronics; ComponentLink12URL: https://datasheet.octopart.com:443/RC0603FR-0712KL-Yageo-datasheet-15599030.pdf?src-supplier=Future+Electronics; ComponentLink12Description: https://datasheet.octopart.com:443/RC0603FR-0712KL-Yageo-datasheet-15599030.pdf?src-supplier=Future+Electronics; ComponentLink13URL: https://datasheet.octopart.com:443/RC0603FR-0712KL-Yageo-datasheet-12596169.pdf?src-supplier=Future+Electronics; ComponentLink13Description: https://datasheet.octopart.com:443/RC0603FR-0712KL-Yageo-datasheet-12596169.pdf?src-supplier=Future+Electronics; ComponentLink14URL: https://datasheet.octopart.com:443/RC0603FR-0712KL-Yageo-datasheet-8324193.pdf?src-supplier=Future+Electronics; ComponentLink14Description: https://datasheet.octopart.com:443/RC0603FR-0712KL-Yageo-datasheet-8324193.pdf?src-supplier=Future+Electronics; ComponentLink15URL: https://datasheet.octopart.com:443/RC0603FR-0712KL-Yageo-Group-datasheet-189192902.pdf?src-supplier=LCSC; ComponentLink15Description: https://datasheet.octopart.com:443/RC0603FR-0712KL-Yageo-Group-datasheet-189192902.pdf?src-supplier=LCSC; ComponentLink16URL: https://datasheet.octopart.com:443/RC0603FR-0712KL-Yageo-Group-datasheet-176638170.pdf?src-supplier=Farnell; ComponentLink16Description: https://datasheet.octopart.com:443/RC0603FR-0712KL-Yageo-Group-datasheet-176638170.pdf?src-supplier=Farnell; ComponentLink17URL: https://datasheet.octopart.com/RC0603FR-0712KL-Yageo-datasheet-73766026.pdf; ComponentLink17Description: https://datasheet.octopart.com/RC0603FR-0712KL-Yageo-datasheet-73766026.pdf; ComponentLink18URL: https://datasheet.octopart.com:443/RC0603FR-0712KL-Yageo-datasheet-30459151.pdf?src-supplier=Seeed+Studio; ComponentLink18Description: https://datasheet.octopart.com:443/RC0603FR-0712KL-Yageo-datasheet-30459151.pdf?src-supplier=Seeed+Studio; ComponentLink19URL: https://datasheet.octopart.com:443/RC0603FR-0712KL-Yageo-datasheet-118562.pdf?src-supplier=DigiKey; ComponentLink19Description: https://datasheet.octopart.com:443/RC0603FR-0712KL-Yageo-datasheet-118562.pdf?src-supplier=DigiKey; ComponentLink20URL: http://sigma.octopart.com:80/conflict_mineral_statement/Yageo-company-3.pdf?src-supplier=Compliance+Statements; ComponentLink20Description: http://sigma.octopart.com:80/conflict_mineral_statement/Yageo-company-3.pdf?src-supplier=Compliance+Statements; ComponentLink21URL: http://sigma.octopart.com:80/rohs_statement/Yageo-company-2.pdf?src-supplier=Compliance+Statements; ComponentLink21Description: http://sigma.octopart.com:80/rohs_statement/Yageo-company-2.pdf?src-supplier=Compliance+Statements; LCSC Part: C114659